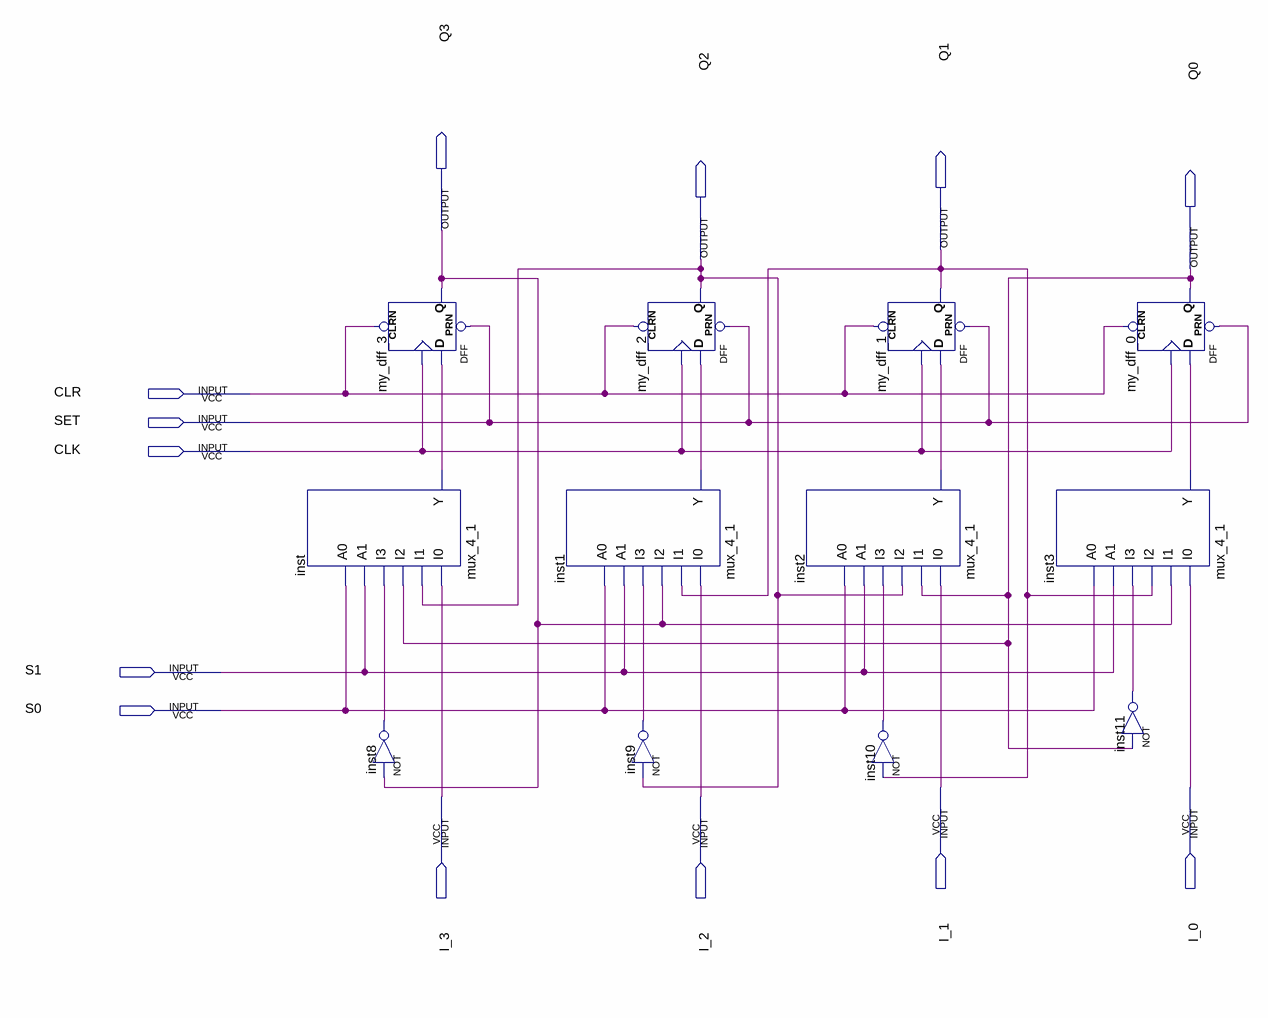
[diagram p0: schematic sheet]
// Quartus schematic my_register.bdf as structural Verilog: 12 symbols, 13 pins
module my_register (
  input  CLR,
  input  SET,
  input  CLK,
  input  S1,
  input  S0,
  input  I_1,
  input  I_0,
  input  I_3,
  input  I_2,
  output Q3,
  output Q1,
  output Q2,
  output Q0
);

  wire inst1_y, inst2_y, inst3_y, inst8_out, inst9_out, inst10_out, inst11_out, inst_y;

  mux_4_1 inst (.I0(I_3), .I1(Q2), .I2(Q0), .I3(inst8_out), .A1(S1), .A0(S0), .Y(inst_y));
  not inst8 (inst8_out, Q3);
  DFF my_dff_3 (.CLRN(CLR), .CLK(CLK), .D(inst_y), .PRN(SET), .Q(Q3));
  mux_4_1 inst1 (.I0(I_2), .I1(Q1), .I2(Q3), .I3(inst9_out), .A1(S1), .A0(S0), .Y(inst1_y));
  DFF my_dff_2 (.CLRN(CLR), .CLK(CLK), .D(inst1_y), .PRN(SET), .Q(Q2));
  not inst9 (inst9_out, Q2);
  mux_4_1 inst2 (.I0(I_1), .I1(Q0), .I2(Q2), .I3(inst10_out), .A1(S1), .A0(S0), .Y(inst2_y));
  DFF my_dff_1 (.CLRN(CLR), .CLK(CLK), .D(inst2_y), .PRN(SET), .Q(Q1));
  not inst10 (inst10_out, Q1);
  mux_4_1 inst3 (.I0(I_0), .I1(Q3), .I2(Q1), .I3(inst11_out), .A1(S1), .A0(S0), .Y(inst3_y));
  DFF my_dff_0 (.CLRN(CLR), .CLK(CLK), .D(inst3_y), .PRN(SET), .Q(Q0));
  not inst11 (inst11_out, Q0);
endmodule
